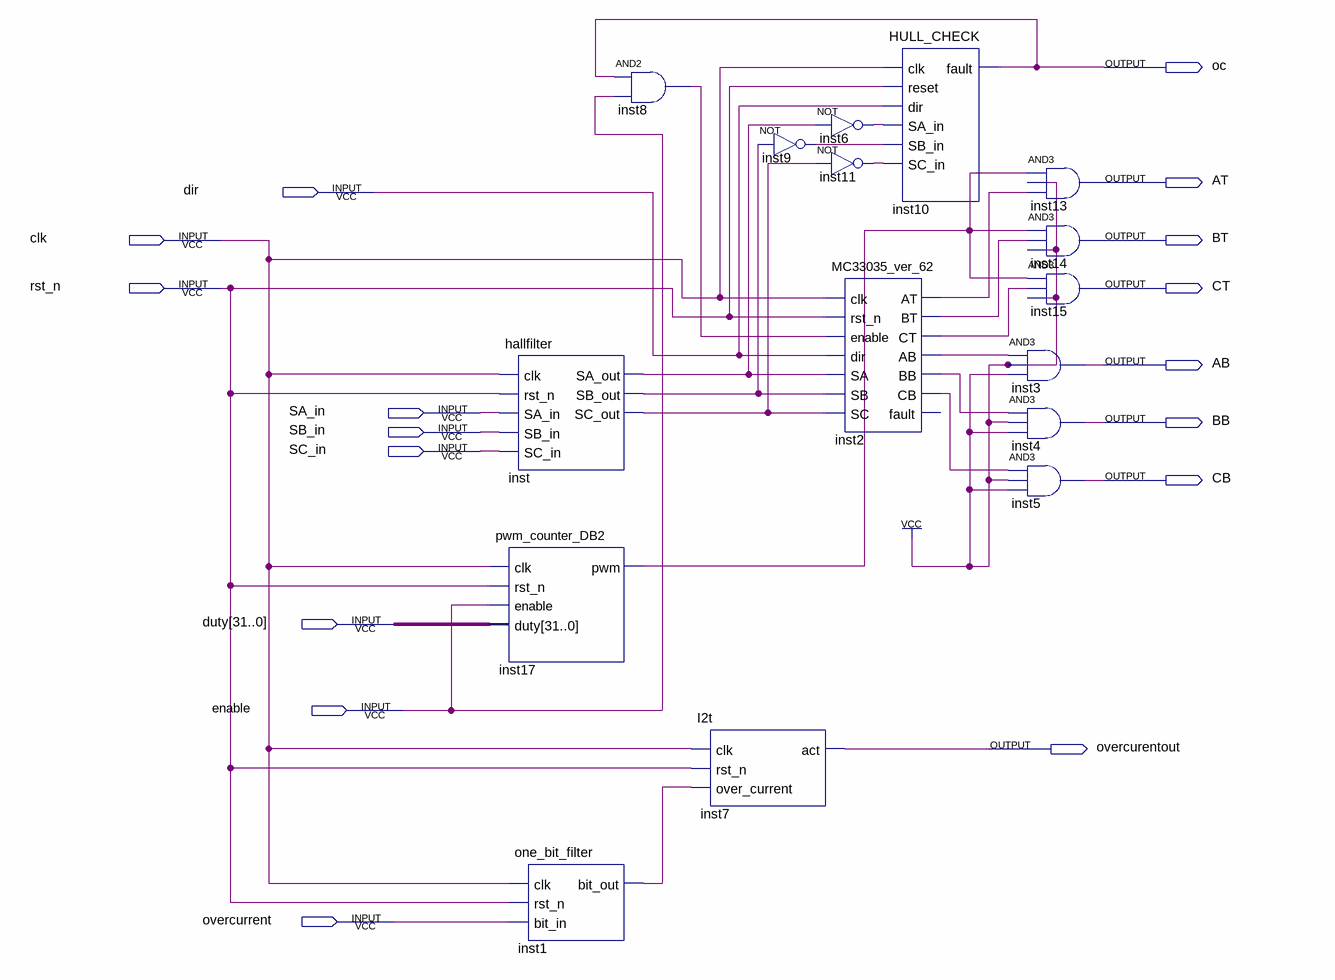
[diagram p0: schematic sheet]
// Quartus schematic 33035_DB2.bdf as structural Verilog: 16 symbols, 17 pins
module \33035_DB2  (
  input  dir,
  input  clk,
  input  rst_n,
  input  SA_in,
  input  SB_in,
  input  SC_in,
  input  [31:0] duty,
  input  enable,
  input  overcurrent,
  output oc,
  output AT,
  output BT,
  output CT,
  output AB,
  output BB,
  output CB,
  output overcurentout
);

  wire inst1_bit_out, inst2_ab, inst2_at, inst2_bb, inst2_bt, inst2_cb, inst2_ct, inst6_out, inst8_out,
       inst9_out, inst11_out, inst17_pwm, inst_sa_out, inst_sb_out, inst_sc_out;

  hallfilter inst (
    .clk(clk), .rst_n(rst_n), .SA_in(SA_in), .SB_in(SB_in), .SC_in(SC_in), .SA_out(inst_sa_out),
    .SB_out(inst_sb_out), .SC_out(inst_sc_out));
  pwm_counter_DB2 inst17 (.clk(clk), .rst_n(rst_n), .enable(enable), .duty(duty), .pwm(inst17_pwm));
  one_bit_filter inst1 (.clk(clk), .rst_n(rst_n), .bit_in(overcurrent), .bit_out(inst1_bit_out));
  and inst8 (inst8_out, oc, enable);
  I2t inst7 (.clk(clk), .rst_n(rst_n), .over_current(inst1_bit_out), .act(overcurentout));
  not inst9 (inst9_out, inst_sb_out);
  not inst6 (inst6_out, inst_sa_out);
  not inst11 (inst11_out, inst_sc_out);
  MC33035_ver_62 inst2 (
    .clk(clk), .rst_n(rst_n), .enable(inst8_out), .dir(dir), .SA(inst_sa_out), .SB(inst_sb_out),
    .SC(inst_sc_out), .AT(inst2_at), .BT(inst2_bt), .CT(inst2_ct), .AB(inst2_ab), .BB(inst2_bb), .CB(inst2_cb));  // open: fault
  HULL_CHECK inst10 (
    .clk(clk), .reset(rst_n), .dir(dir), .SA_in(inst6_out), .SB_in(inst9_out), .SC_in(inst11_out), .fault(oc));
  and inst3 (AB, inst2_ab, 1'b1, 1'b1);
  and inst4 (BB, inst2_bb, 1'b1, 1'b1);
  and inst5 (CB, inst2_cb, 1'b1, 1'b1);
  and inst13 (AT, inst17_pwm, 1'b1, inst2_at);
  and inst14 (BT, inst17_pwm, inst2_bt, 1'b1);
  and inst15 (CT, inst17_pwm, inst2_ct, 1'b1);
endmodule
